# Altium schematic sheet oai_cm_main.SchDoc: =GlobalProjectName
size 209 x 297 mm; SheetNumber: 1; SheetTotal: 6; PageSetup: Record=PageOptions|CenterHorizontal=True|CenterVertical=True|PrintScale=1.00|XCorrection=1.00|YCorrection=1.00|PrintKind=1|BorderSize=5000000|LeftOffset=0|BottomOffset=0|Orientation=2|PaperLength=1000|PaperWidth=1000|Scale=100|PaperSource=15|PrintQuality=1200|MediaType=1|DitherType=10|PaperKind=A3|PrintScaleMode=1; Weight: -; ScaleFactor: -
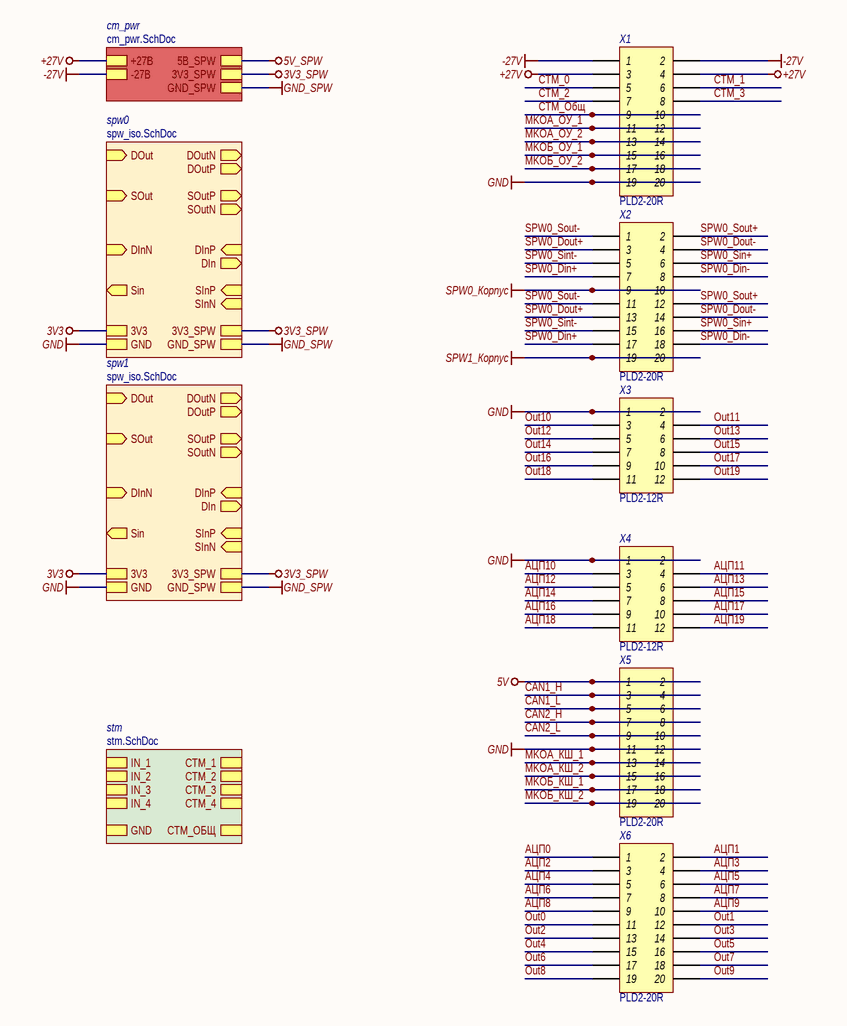
[diagram p0: oai_cm_main.SchDoc]

## Parts
X1  Header 2X20  [PLD2-20R]  (value not drawn)
X2  Header 2X20  [PLD2-20R]  (value not drawn)
X3  Header 2X12  [PLD2-12R]  (value not drawn)
X4  Header 2X12  [PLD2-12R]  (value not drawn)
X5  Header 2X20  [PLD2-20R]  (value not drawn)
X6  Header 2X20  [PLD2-20R]  (value not drawn)

## Sub-sheets
cm_pwr = cm_pwr.SchDoc: +27В, -27В, 5В_SPW, 3V3_SPW, GND_SPW
spw0 = spw_iso.SchDoc: DOutN (out), DOutP (out), SOutP (out), SInP (in), DOut (in), SInN (in), SOutN (out), DIn (out), DInN (in), DInP (in), SOut (in), Sin (out), GND, 3V3, 3V3_SPW, GND_SPW
spw1 = spw_iso.SchDoc: DOutN (out), DOutP (out), SOutP (out), SInP (in), DOut (in), SInN (in), SOutN (out), DIn (out), DInN (in), DInP (in), SOut (in), Sin (out), GND, 3V3, 3V3_SPW, GND_SPW
stm = stm.SchDoc: СТМ_4, IN_3, GND, СТМ_3, СТМ_1, IN_4, IN_2, IN_1, СТМ_ОБЩ, СТМ_2

## Nets
3V3: sheet spw0/3V3, sheet spw1/3V3
3V3_SPW: sheet spw0/3V3_SPW, sheet cm_pwr/3V3_SPW, sheet spw1/3V3_SPW
5V: X5.1 X5.2
5V_SPW: sheet cm_pwr/5В_SPW
+27V: X1.3 X1.4 ; sheet cm_pwr/+27В
-27V: X1.1 X1.2 ; sheet cm_pwr/-27В
GND: X1.19 X1.20 X3.1 X3.2 X4.1 X4.2 X5.11 X5.12 ; sheet spw0/GND, sheet spw1/GND
GND_SPW: sheet spw0/GND_SPW, sheet cm_pwr/GND_SPW, sheet spw1/GND_SPW
SPW0_Корпус: X2.9 X2.10
SPW1_Корпус: X2.19 X2.20
CAN1_H: X5.3 X5.4
CAN1_L: X5.5 X5.6
CAN2_H: X5.7 X5.8
CAN2_L: X5.9 X5.10
MKOА_КШ_1: X5.13 X5.14
MKOА_КШ_2: X5.15 X5.16
MKOА_ОУ_1: X1.11 X1.12
MKOА_ОУ_2: X1.13 X1.14
MKOБ_КШ_1: X5.17 X5.18
MKOБ_КШ_2: X5.19 X5.20
MKOБ_ОУ_1: X1.15 X1.16
MKOБ_ОУ_2: X1.17 X1.18
Out0: X6.11
Out1: X6.12
Out2: X6.13
Out3: X6.14
Out4: X6.15
Out5: X6.16
Out6: X6.17
Out7: X6.18
Out8: X6.19
Out9: X6.20
Out10: X3.3
Out11: X3.4
Out12: X3.5
Out13: X3.6
Out14: X3.7
Out15: X3.8
Out16: X3.9
Out17: X3.10
Out18: X3.11
Out19: X3.12
SPW0_Din+: X2.7 X2.17
SPW0_Din-: X2.8 X2.18
SPW0_Dout+: X2.3 X2.13
SPW0_Dout-: X2.4 X2.14
SPW0_Sin+: X2.6 X2.16
SPW0_Sint-: X2.5 X2.15
SPW0_Sout+: X2.2 X2.12
SPW0_Sout-: X2.1 X2.11
АЦП0: X6.1
АЦП1: X6.2
АЦП2: X6.3
АЦП3: X6.4
АЦП4: X6.5
АЦП5: X6.6
АЦП6: X6.7
АЦП7: X6.8
АЦП8: X6.9
АЦП9: X6.10
АЦП10: X4.3
АЦП11: X4.4
АЦП12: X4.5
АЦП13: X4.6
АЦП14: X4.7
АЦП15: X4.8
АЦП16: X4.9
АЦП17: X4.10
АЦП18: X4.11
АЦП19: X4.12
СТМ_0: X1.5
СТМ_1: X1.6
СТМ_2: X1.7
СТМ_3: X1.8
СТМ_Общ: X1.9 X1.10

## Notes on the sheet
- Перв. примен.
- Справ. №
- Подп. и дата
- Инв. № дубл.
- Взам. инв. №
- Разраб.
- Изм.
- Лист
- № докум.
- Подп.
- Дата
- Литера
- Масса
- Масштаб
- Пров.
- Т.контр.
- Листов
- Инв. № подл.
- Н.контр.
- Утв.
- Форма 1 ГОСТ 2.104-2006
- Копировал
- Формат А4

## Library data of the parts
X1 X2 X5 X6 = Header 2X20: Header, 20-Pin, Dual row; Потребление, Вт: 0,0; Назначение: Header, 20-Pin, Dual row; Наименование: PLD2-20R
X3 X4 = Header 2X12: Header, 12-Pin, Dual row; Потребление, Вт: 0,0; Назначение: Header, 12-Pin, Dual row; Наименование: PLD2-12R